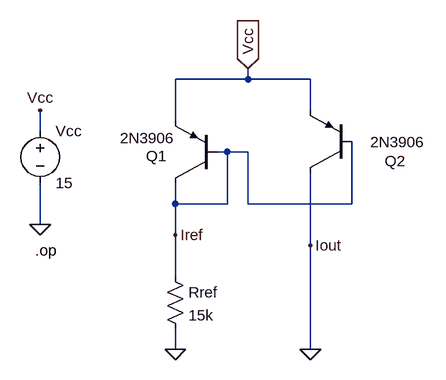
[diagram p0: schematic Lab5.3-part-A-discrete_pnp.asc]
Lab5.3-part-A-discrete_pnp.asc, the LTspice schematic file:
Version 4
SHEET 1 880 680
WIRE 208 16 208 0
WIRE 208 16 96 16
WIRE 304 16 208 16
WIRE 304 64 304 16
WIRE 96 80 96 16
WIRE -112 96 -112 64
WIRE 176 128 160 128
WIRE 208 128 176 128
WIRE 96 208 96 176
WIRE 176 208 176 128
WIRE 176 208 96 208
WIRE 208 208 208 128
WIRE 368 208 368 112
WIRE 368 208 208 208
WIRE -112 240 -112 176
WIRE 96 256 96 208
WIRE 304 272 304 160
WIRE 96 320 96 256
WIRE 96 432 96 400
WIRE 304 432 304 272
FLAG -112 240 0
FLAG -112 64 Vcc
FLAG 208 0 Vcc
IOPIN 208 0 In
FLAG 304 432 0
FLAG 96 432 0
FLAG 96 256 Iref
FLAG 304 272 Iout
SYMBOL pnp 160 176 R180
WINDOW 0 77 42 Left 2
WINDOW 3 64 69 Left 2
SYMATTR InstName Q1
SYMATTR Value 2N3906
SYMBOL voltage -112 80 R0
SYMATTR InstName Vcc
SYMATTR Value 15
SYMBOL pnp 368 160 R180
WINDOW 0 -83 18 Left 2
WINDOW 3 -113 47 Left 2
SYMATTR InstName Q2
SYMATTR Value 2N3906
SYMBOL res 80 304 R0
SYMATTR InstName Rref
SYMATTR Value 15k
TEXT -120 280 Left 2 !.op

The netlist it stands for:
* Lab5.3-part-A-discrete_pnp.asc
Q1 Iref Iref Vcc 0 2N3906
Vcc Vcc 0 15
Q2 0 Iref Vcc 0 2N3906
Rref Iref 0 15k
.model NPN NPN
.model PNP PNP
.lib standard.bjt
.op
.backanno
.end